# EAGLE design main_board (EAGLE 6.3)
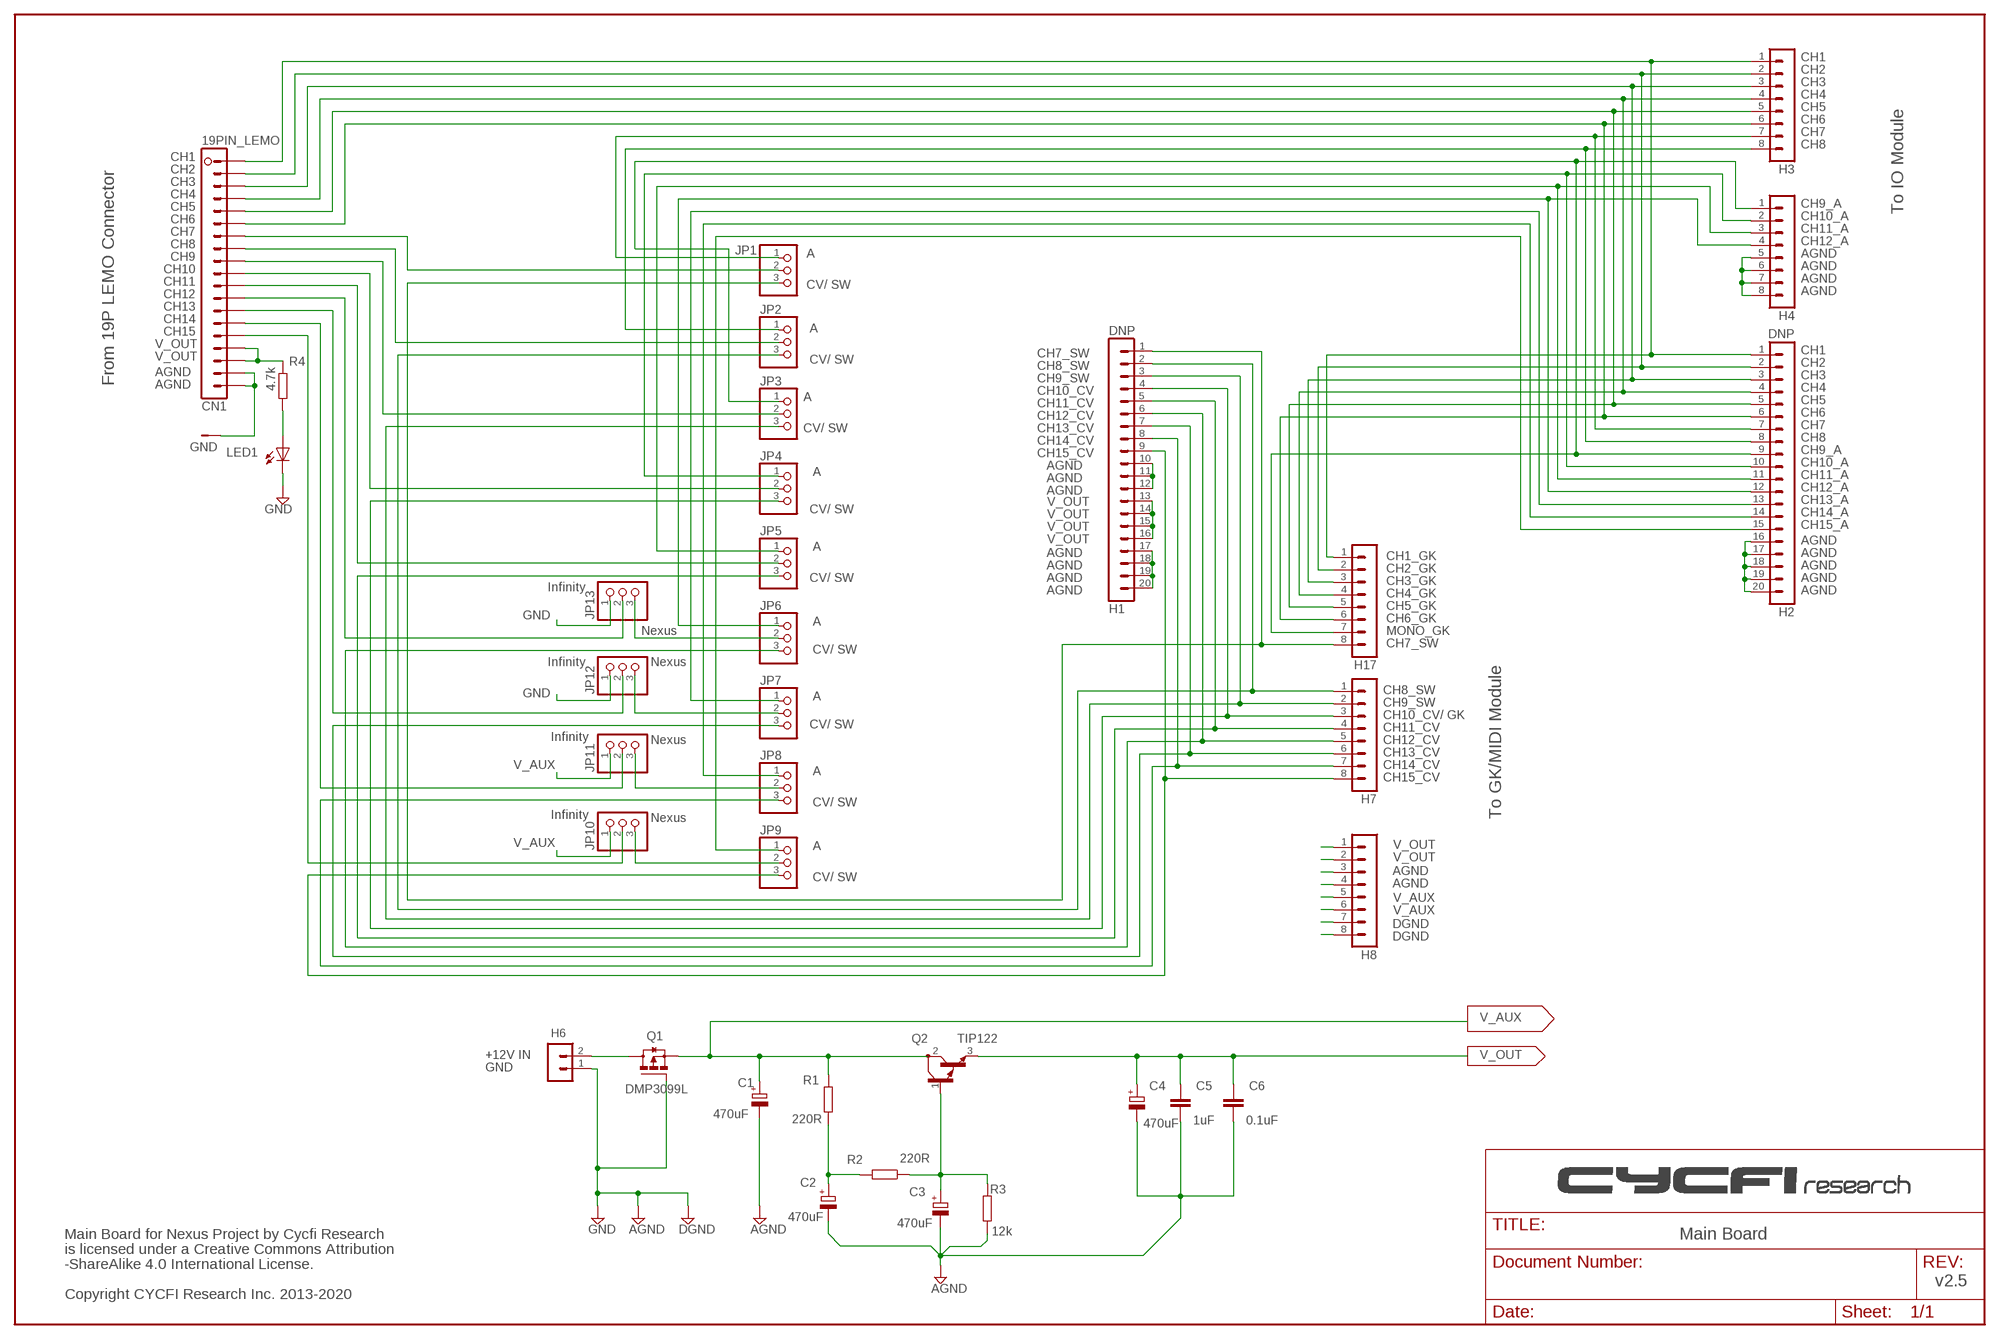
[diagram p0: schematic, sheet 1]

## Parts
C1  470uF  CPOL-EU140CLH-1010  [140CLH-1010]
C2  470uF  CPOL-EU140CLH-1010  [140CLH-1010]
C3  470uF  CPOL-EU140CLH-1010  [140CLH-1010]
C4  470uF  CPOL-EU140CLH-1010  [140CLH-1010]
C5  1uF  C-EUC0603  [C0603]
C6  0.1uF  C-EUC0603  [C0603]
CN1  19PIN_LEMO  [19PIN_LEMO]
GND  TH-PAD-1.6/0.8  [TH-PAD-1.6/0.8]
H1  DNP  MA20-1  [MA20-1]
H2  DNP  MA20-1  [MA20-1]
H3  MA08-1  [MA08-1]
H4  MA08-1  [MA08-1]
H6  MA02-1  [MA02-1]
H7  MA08-1  [MA08-1]
H8  MA08-1  [MA08-1]
H17  MA08-1  [MA08-1]
JP1  PINHD-1X03_2.00  [1X03M]
JP2  PINHD-1X03_2.00  [1X03M]
JP3  PINHD-1X03_2.00  [1X03M]
JP4  PINHD-1X03_2.00  [1X03M]
JP5  PINHD-1X03_2.00  [1X03M]
JP6  PINHD-1X03_2.00  [1X03M]
JP7  PINHD-1X03_2.00  [1X03M]
JP8  PINHD-1X03_2.00  [1X03M]
JP9  PINHD-1X03_2.00  [1X03M]
JP10  PINHD-1X03_2.00  [1X03M]
JP11  PINHD-1X03_2.00  [1X03M]
JP12  PINHD-1X03_2.00  [1X03M]
JP13  PINHD-1X03_2.00  [1X03M]
LED1  LED3MM  [LED3MM]
Q1  DMP3099L  P_MOSFET  [SOT23]
Q2  TIP122  [TO-220H]
R1  220R  R-EU_R0603  [R0603]
R2  220R  R-EU_R0603  [R0603]
R3  12k  R-EU_R0603  [R0603]
R4  4.7k  R-EU_R0402  [R0402]

## Nets
GND: C1.- C2.- C3.- C4.- C5.2 C6.2 CN1.P$18 CN1.P$19 GND.1(P) H1.10 H1.11 H1.12 H1.17 H1.18 H1.19 H1.20 H2.16 H2.17 H2.18 H2.19 H2.20 H4.5 H4.6 H4.7 H4.8 H6.1 H8.3 H8.4 H8.7 H8.8 JP12.1 JP13.1 LED1.K(C) Q1.1(G) R3.1 ; supply symbol labelled AGND, DGND
N$1: CN1.P$2 H2.2 H3.2 H17.2
N$2: CN1.P$1 H2.1 H3.1 H17.1
N$3: CN1.P$8 JP2.2
N$4: H6.2 Q1.3(D)
N$5: H1.2 H7.1 JP2.3
N$6: C3.+ Q2.1(B) R2.1 R3.2
N$7: H1.1 H17.8 JP1.3
N$8: C2.+ R1.1 R2.2
N$9: CN1.P$5 H2.5 H3.5 H17.5
N$10: JP9.2 JP10.3
N$11: H2.7 H3.7 JP1.1
N$12: CN1.P$7 JP1.2
N$13: H1.3 H7.2 JP3.3
N$14: CN1.P$10 JP4.2
N$15: CN1.P$11 JP5.2
N$16: CN1.P$12 JP13.2
N$17: CN1.P$9 JP3.2
N$18: H2.10 H4.2 JP4.1
N$19: H2.13 JP7.1
N$21: H2.14 JP8.1
N$22: H2.15 JP9.1
N$23: JP8.2 JP11.3
N$25: LED1.A R4.2
N$26: H1.5 H7.4 JP5.3
N$27: H1.4 H7.3 JP4.3
N$28: H2.12 H4.4 JP6.1
N$29: H2.11 H4.3 JP5.1
N$30: H1.6 H7.5 JP6.3
N$31: CN1.P$3 H2.3 H3.3 H17.3
N$32: H2.9 H4.1 H17.7 JP3.1
N$33: H1.7 H7.6 JP7.3
N$34: H1.8 H7.7 JP8.3
N$35: H1.9 H7.8 JP9.3
N$36: CN1.P$13 JP12.2
N$37: CN1.P$14 JP11.2
N$38: CN1.P$15 JP10.2
N$39: CN1.P$4 H2.4 H3.4 H17.4
N$40: JP7.2 JP12.3
N$41: CN1.P$6 H2.6 H3.6 H17.6
N$43: H2.8 H3.8 JP2.1
N$44: JP6.2 JP13.3
V_AUX: C1.+ H8.5 H8.6 JP10.1 JP11.1 Q1.2(S) Q2.2(C) R1.2
V_OUT: C4.+ C5.1 C6.1 CN1.P$16 CN1.P$17 H1.13 H1.14 H1.15 H1.16 H8.1 H8.2 Q2.3(E) R4.1

## Notes on the sheet
- CH1
- CH2
- CH3
- CH4
- CH5
- CH6
- CH7
- CH8
- CH1
- CH2
- CH3
- CH4
- CH5 | CH9_A
- To IO Module
- CH6 | CH10_A
- CH7 | CH11_A
- CH8 | CH12_A
- CH9 | A | AGND
- CH10 | AGND
- CH11 | AGND
- CV/ SW
- CH12 | AGND
- CH13
- CH14
- CH15 | A
- V_OUT
- CH7_SW | CH1
- V_OUT | CV/ SW
- CH8_SW | CH2
- AGND | CH3
- From 19P LEMO Connector | CH9_SW
- AGND | CH4
- CH10_CV
- A | CH5
- CH11_CV
- CH12_CV | CH6
- CV/ SW | CH13_CV | CH7
- CH14_CV | CH8
- CH15_CV | CH9_A
- AGND | CH10_A
- A | CH11_A
- AGND
- AGND | CH12_A
- V_OUT | CH13_A
- CV/ SW | CH14_A
- V_OUT
- V_OUT | CH15_A
- V_OUT | AGND
- A
- AGND | CH1_GK | AGND
- AGND | CH2_GK | AGND
- CV/ SW | AGND | CH3_GK | AGND
- Infinity | AGND | AGND
- CH4_GK
- CH5_GK
- A | CH6_GK
- Nexus | MONO_GK
- CH7_SW
- CV/ SW
- Infinity | Nexus
- CH8_SW
- A
- CH9_SW
- CH10_CV/ GK
- CV/ SW | CH11_CV
- Infinity | Nexus | CH12_CV
- CH13_CV
- CH14_CV
- A
- CH15_CV
- CV/ SW
- Infinity | Nexus | To GK/MIDI Module
- A | V_OUT
- V_OUT
- AGND
- CV/ SW
- AGND
- V_AUX
- V_AUX
- DGND
- DGND
- H6
- +12V IN
- GND
- Main Board
- v2.5
- Main Board for Nexus Project by Cycfi Research
  is licensed under a Creative Commons Attribution
  -ShareAlike 4.0 International License.
  
  Copyright CYCFI Research Inc. 2013-2020

## Library data of the parts
C1-C4 = resistor:CPOL-EU: POLARIZED CAPACITOR, European symbol
C5 C6 = resistor:C-EU: CAPACITOR, European symbol
CN1 = CYCFI_Con:19PIN_LEMO
GND = CYCFI_Con:TH-PAD-1.6/0.8
H1 H2 = con-lstb:MA20-1: PIN HEADER; OC_FARNELL: unknown; OC_NEWARK: unknown
H3 H4 H7 H8 H17 = con-lstb:MA08-1: PIN HEADER; OC_FARNELL: unknown; OC_NEWARK: unknown
H6 = con-lstb:MA02-1
JP1-JP13 = pinhead-2:PINHD-1X03: PIN HEADER
LED1 = led:LED: LED OSRAM: - CHIPLED LG R971, LG N971, LY N971, LG Q971, LY Q971, LO R971, LY R971 LH N974, LH R974 LS Q976, LO Q976, LY Q976 LO Q996 - Hyper CHIPLED LW Q18S LB Q993, LB Q99A, LB R99A - SideLED LS A670, LO A670, LY A670, LG A670, LP A670 LB A673, LV A673, LT A673, LW A673 LH A674 LY A675 LS A676, LA A676, LO A676, LY A676, LW A676 LS A679, LY A679, LG A679 - Hyper Micro SIDELED® LS Y876, LA Y876, LO Y876, LY Y876 LT Y87S - SmartLED LW L88C, LW L88S LB L89C, LB L89S, LG L890 LS L89K, LO L89K, LY L89K LS L896, LA L896, LO L896, LY L896 - TOPLED LS T670, LO T670, LY T670, LG T670, LP T670 LSG T670, LSP T670, LSY T670, LOP T670, LYG T670 LG T671, LOG T671, LSG T671 LB T673, LV T673, LT T673, LW T673 LH T674 LS T676, LA T676, LO T676, LY T676, LB T676, LH T676, LSB T676, LW T676 LB T67C, LV T67C, LT T67C, LS T67K, LO T67K, LY T67K, LW E67C LS E67B, LA E67B, LO E67B, LY E67B, LB E67C, LV E67C, LT E67C LW T67C LS T679, LY T679, LG T679 LS T770, LO T770, LY T770, LG T770, LP T770 LB T773, LV T773, LT T773, LW T773 LH T774 LS E675, LA E675, LY E675, LS T675 LS T776, LA T776, LO T776, LY T776, LB T776 LHGB T686 LT T68C, LB T68C - Hyper Mini TOPLED® LB M676 - Mini TOPLED Santana® LG M470 LS M47K, LO M47K, LY M47K Source: http://www.osram.convergy.de LUXEON: - LUMILED® LXK2-PW12-R00, LXK2-PW12-S00, LXK2-PW14-U00, LXK2-PW14-V00 LXK2-PM12-R00, LXK2-PM12-S00, LXK2-PM14-U00 LXK2-PE12-Q00, LXK2-PE12-R00, LXK2-PE12-S00, LXK2-PE14-T00, LXK2-PE14-U00 LXK2-PB12-K00, LXK2-PB12-L00, LXK2-PB12-M00, LXK2-PB14-N00, LXK2-PB14-P00, LXK2-PB14-Q00 LXK2-PR12-L00, LXK2-PR12-M00, LXK2-PR14-Q00, LXK2-PR14-R00 LXK2-PD12-Q00, LXK2-PD12-R00, LXK2-PD12-S00 LXK2-PH12-R00, LXK2-PH12-S00 LXK2-PL12-P00, LXK2-PL12-Q00, LXK2-PL12-R00 Source: www.luxeon.com KINGBRIGHT: KA-3528ASYC Source: www.kingbright.com
Q1 = CYCFI_semicon:P_MOSFET
Q2 = CYCFI_semicon:TIP122
R1-R4 = resistor:R-EU_: RESISTOR, European symbol

## Board
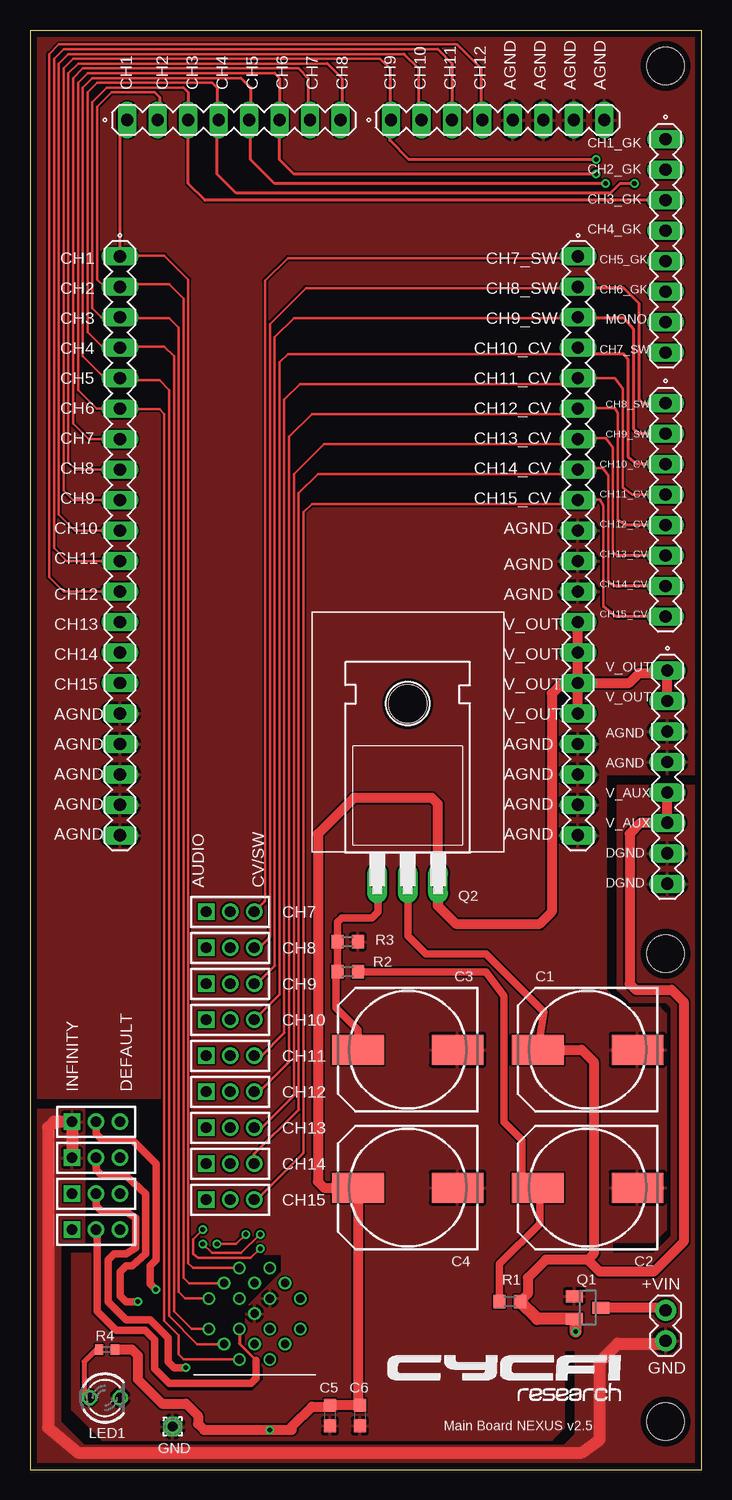
[diagram p1: board, top side]
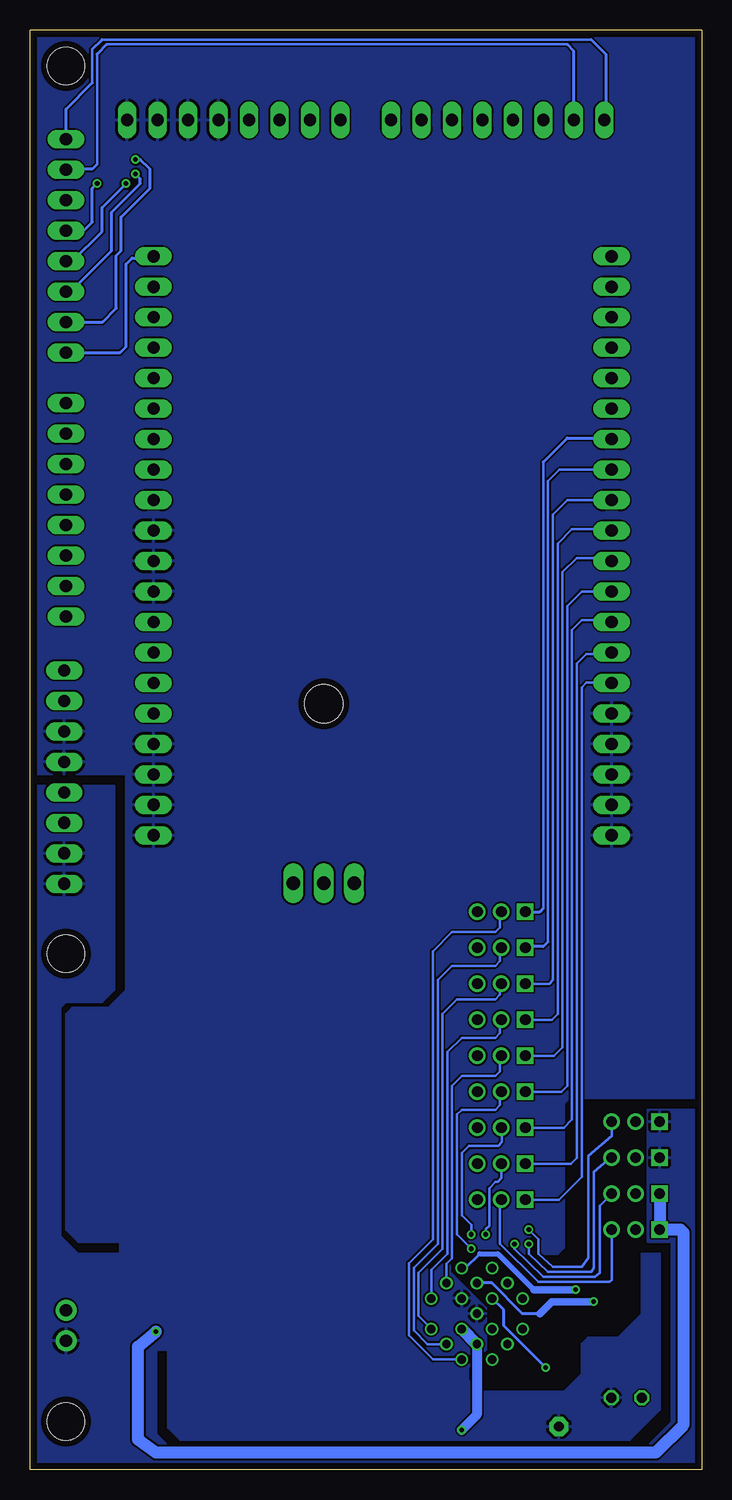
[diagram p2: board, bottom side, seen from below]

Size 56 x 120 mm. Coordinates in mm from the lower left corner, seen from the top.
Outline: 0,0 56,0 56,120 0,120 0,0
Copper layers (1*16): Top 0.035mm / dielectric 1.6mm / Bottom 0.035mm
Design rules "Elecrow_2-layer_PCB_eagle_rule": minimum track width 6mil, minimum drill 12mil, track to track 6mil, track to pad 8mil, pad to pad 12mil, via to via 12mil, smd to smd 0mil, copper to edge 20mil, drill to drill 10mil, minimum pad ring 6mil, minimum via ring 6mil, stop-mask expansion 0mil, vias tented up to drill 100mil, thermal gap 10mil
Holes 3.1 mm at 53,117 53,43 53,4
Holes 3.2 mm at 31.5,63.85

### Footprints (pad centres in the part's own frame; a part is rotated, then mirrored left to right if it is on the bottom)
140CLH-1010 = smd 4.3 x 2.5: + 4.15,0; - -4.15,0
C0603 = smd 1.1 x 1: 1 -0.85,0; 2 0.85,0
19PIN_LEMO = drill 0.7: P$1 -3.81,-1.27; P$2 -2.54,-2.54; P$3 -1.27,-3.81; P$4 1.27,-3.81; P$5 2.54,-2.54; P$6 3.81,-1.27; P$7 3.81,1.27; P$8 2.54,2.54; P$9 1.27,3.81; P$10 -1.27,3.81; P$11 -2.54,2.54; P$12 -3.81,1.27; P$13 -2.54,0; P$14 -1.27,-1.27; P$15 1.27,-1.27; P$16 2.54,0; P$17 1.27,1.27; P$18 -1.27,1.27; P$19 0,0
TH-PAD-1.6/0.8 = drill 0.813 pad 1.6 octagon: 1 0,0
MA20-1 = drill 1.016 long: 1 -24.13,0; 2 -21.59,0; 3 -19.05,0; 4 -16.51,0; 5 -13.97,0; 6 -11.43,0; 7 -8.89,0; 8 -6.35,0; 9 -3.81,0; 10 -1.27,0; 11 1.27,0; 12 3.81,0; 13 6.35,0; 14 8.89,0; 15 11.43,0; 16 13.97,0; 17 16.51,0; 18 19.05,0; 19 21.59,0; 20 24.13,0
MA08-1 = drill 1.016 long: 1 -8.89,0; 2 -6.35,0; 3 -3.81,0; 4 -1.27,0; 5 1.27,0; 6 3.81,0; 7 6.35,0; 8 8.89,0
MA02-1 = drill 1.016 pad 1.75: 1 -1.27,0; 2 1.27,0
1X03M = drill 0.914 square: 1 -2,0 | drill 0.914: 2 0,0; 3 2,0
LED3MM = drill 0.813 octagon: A -1.27,0; K 1.27,0
SOT23 = smd 1 x 1.4: 1 -0.95,-1.1; 2 0.95,-1.1; 3 0,1.1
TO-220H = drill 1.118 long: 1 -2.54,-7.62; 2 0,-7.62; 3 2.54,-7.62
R0603 = smd 1 x 1.1: 1 -0.85,0; 2 0.85,0
R0402 = smd 0.7 x 0.9: 1 -0.65,0; 2 0.65,0

### Placement (x,y rotation side)
C1  46.5,35 180 top
C2  46.5,23.5 180 top
C3  31.5,35 180 top
C4  31.5,23.5 180 top
C5  25,4.5 270 top
C6  27.5,4.5 270 top
CN1  18.73,12.99 270 top
GND  11.9,3.58 0 top
H1  45.7,77 270 top
H2  7.5,77 270 top
H3  17,112.5 0 top
H4  39,112.5 0 top
H6  53,12 90 top
H7  53,80 270 top
H8  53.15,57.72 270 top
H17  53,102 270 top
JP1  16.7,46.5 0 top
JP2  16.7,43.5 0 top
JP3  16.7,40.5 0 top
JP4  16.7,37.5 0 top
JP5  16.7,34.5 0 top
JP6  16.7,31.5 0 top
JP7  16.7,28.5 0 top
JP8  16.7,25.5 0 top
JP9  16.7,22.5 0 top
JP10  5.5,20 0 top
JP11  5.5,23 0 top
JP12  5.5,26 0 top
JP13  5.5,29 0 top
LED1  6.25,5.97 0 top
Q1  46.5,13.5 270 top
Q2  31.5,56.5 0 top
R1  40.01,14 0 top
R2  26.5,41.5 0 top
R3  26.5,44 180 top
R4  6.42,10 180 top

### Tracks (layer width: path | path; a pad name or v marks a point on that pad's centre or on a via)
GND
  Top 1.016: H6.1 52.77,10.5 49,10.5 47.5,9 47.5,2.5 46,1.4 4,1.4 1.5,3.5 1.5,28.5 2,29 JP13.1 JP12.1
  pour Top: 56,57 49,57 49,40 50,39 53,39 53.5,38.5 53.5,19.5 52,18 48.5,18 48.5,19 52,19 53,20 53,38 52.5,38.5 49.5,38.5 48,40 48,58 56,58 56,120 0,120 0,31 11,31 11.5,30.5 11.5,18.5 12,18 21,18 21,16.5 18,13.5 18,10 19.5,8.5 19.5,7.5 18.5,6.5 11.5,6.5 10,8 10,10.5 9.5,11 7,11 5,13 5,18 3.5,18 3.5,5 6,2.5 43.5,2.5 44.5,3.5 44.5,10 45.5,10 45.5,3 44.5,2 4.5,2 2.5,4 2.5,19 4.5,19 4.5,30 0,30 0,0 56,0
  pour Bottom: 56,57 49,57 49,40 50,39 53,39 53.5,38.5 53.5,19.5 52,18 48.5,18 48.5,19 52,19 53,20 53,38 52.5,38.5 49.5,38.5 48,40 48,58 56,58 56,120 0,120 0,31 11,31 11.5,30.5 11.5,18.5 12,18 21,18 21,16.5 18,13.5 18,10 19.5,8.5 19.5,7.5 18.5,6.5 11.5,6.5 10,8 10,10.5 9.5,11 7,11 5,13 5,18 3.5,18 3.5,5 6,2.5 43.5,2.5 44.5,3.5 44.5,10 45.5,10 45.5,3 44.5,2 4.5,2 2.5,4 2.5,19 4.5,19 4.5,30 0,30 0,0 56,0
N$1
  Top 0.203: CN1.P$2 13.27,15.53 12.8,16 12.8,97.6 11.6,98.8 7.71,98.8 H2.2 6.21,98.59 5.6,99.2 5.6,113.6 6.8,114.8 10.4,114.8
  Top 0.254: 10.4,114.8 10.8,114.4 10.8,113.15 H3.2
  Bottom 0.203: 11.2,118.8 49.6,118.8 | 50.4,118 50.4,108.8
  Bottom 0.254: H3.2 10.65,118.25 11.2,118.8 | 49.6,118.8 50.4,118 | 50.4,108.8 50.8,108.4 52.95,108.4 H17.2
N$2
  Top 0.203: CN1.P$1 13.6,16.8 13.2,17.2 13.2,99.2 11.2,101.2 7.57,101.2 H2.1
  Top 0.254: H2.1 7.5,112.39 H3.1
  Bottom 0.203: 50.8,115.6 50.8,118.4 | 50,119.2 9.2,119.2
  Bottom 0.254: H17.1 53,113.4 50.8,115.6 | 50.8,118.4 50,119.2 | 9.2,119.2 8,118 8,113.11 H3.1
N$3
  Bottom 0.203: CN1.P$8 22.85,10.45 24,11.6 24,16.8 22,18.8 22,40.8 20.8,42 17.2,42 16.8,42.4 16.8,43.4 JP2.2
N$4
  Top 0.813: H6.2 52.77,13.5 Q1.3
N$5
  Top 0.203: 20,44.4 20,95.5 23,98.5 45.61,98.5 H1.2
  Top 0.254: JP2.3 19.1,43.5 20,44.4 | H7.1 52.91,88.8 51.2,88.8 50.8,89.2 50.8,97.2 49.5,98.5 45.79,98.5 H1.2
N$6
  Top 0.61: C3.+ 27.35,36.65 25.5,38.5 25.5,41.35 R2.1 R3.2 25.65,45.65 26,46 28.5,46 29,46.5 29,48.74 Q2.1
N$7
  Top 0.203: 19.6,47.4 19.6,99.1 21.5,101 45.57,101 H1.1
  Top 0.254: 19.6,47.4 JP1.3
  Bottom 0.254: H17.8 48.49,93.11 48,93.6 48,100.5 47.5,101 45.83,101 H1.1
N$8
  Top 0.406: 41.35,23 41,23
  Top 0.61: R1.1 39.16,17.16 42.5,20.5 42.5,23.35 C2.+ | 41,23 41,27.5 39.5,29 39.5,39.5 38,41.5 R2.2
  Top 1.016: 41.35,23 C2.+
N$9  (via drill 0.4)
  Top 0.203: CN1.P$5 13.95,10.45 11.6,12.8 11.6,90 10.8,90.8 7.67,90.8 H2.5 6.23,90.97 4.4,92.8 4.4,115.2 5.2,116 17.6,116
  Top 0.254: 17.6,116 18.4,115.2 18.4,113.13 H3.5 18.4,112.87 18.4,109.2 20.4,107.2 v48,107.2
  Bottom 0.254: H17.5 52.47,100.73 50,103.2 50,105.2 v48,107.2
N$10
  Bottom 0.203: JP10.3 7.5,15.8 7.7,15.65 13.6,15.65 16.8,18.8 16.8,22.4 JP9.2
N$11
  Top 0.203: H2.7 4.91,85.89 3.6,87.2 3.6,116 4.4,116.8 22.4,116.8
  Top 0.254: 22.4,116.8 23.2,116 23.2,113.15 H3.7
  Bottom 0.203: 13.2,46.8 13.2,84
  Bottom 0.254: JP1.1 13.5,46.5 13.2,46.8 | 13.2,84 11.2,86 7.61,86 H2.7
N$12
  Bottom 0.203: CN1.P$7 22.38,9.18 24.4,11.2 24.4,17.2 22.4,19.2 22.4,43.2 20.8,44.8 17.2,44.8 16.8,45.2 16.8,46.4 JP1.2
N$13
  Top 0.203: 20.4,42 20.4,94.4 22,96 45.65,96 H1.3
  Top 0.254: JP3.3 18.9,40.5 20.4,42 | H7.2 50.85,86.35 50.34,86.74 50.34,95.04 49.5,96 45.75,96 H1.3
N$14
  Bottom 0.203: CN1.P$10 22.54,16.66 21.2,18 21.2,34.8 20,36 17.2,36 16.8,36.4 16.8,37.4 JP4.2
N$15
  Bottom 0.203: CN1.P$11 21.27,17.13 20.8,17.6 20.8,32 20,32.8 17.2,32.8 16.8,33.2 16.8,34.4 JP5.2
N$16  (via drill 0.4)
  Top 0.61: v10.5,15 10,15.5 10,17 10.5,17.5 10.5,25.5 8.5,27.5 6,27.5 5.5,28 JP13.2
  Bottom 0.254: CN1.P$12 19.7,16.8 18.5,18
  Bottom 0.406: 18.5,18 17,18 14,15
  Bottom 0.61: 14,15 v10.5,15
N$17
  Bottom 0.203: CN1.P$9 22.54,11.74 23.6,12.8 23.6,16.4 21.6,18.4 21.6,38 20.4,39.2 17.2,39.2 16.8,39.6 16.8,40.4 JP3.2
N$18
  Top 0.203: H2.10 3.73,78.27 2.4,79.6 2.4,117.2 3.2,118 31.2,118
  Top 0.254: 31.2,118 32.4,116.8 32.4,113.25 H4.2
  Bottom 0.203: JP4.1 12.5,37.5 12,38 12,77.2 10.8,78.4 7.63,78.4 H2.10
N$19
  Bottom 0.203: JP7.1 11.5,28.5 10.8,29.2 10.8,70 10,70.8 7.65,70.8 H2.13
N$21
  Bottom 0.203: JP8.1 10.9,25.5 10.4,26 10.4,67.2 9.6,68 7.61,68 H2.14
N$22
  Bottom 0.203: JP9.1 11.9,22.5 10,24.4 10,65.2 9.6,65.6 7.53,65.6 H2.15
N$23  (via drill 0.4)
  Top 0.203: v15.6,18.8 17.2,18.8 v18,19.6
  Bottom 0.203: JP11.3 8.5,22 8.5,16.4 8.9,16.05 13.2,16.05 15.6,18.4 v15.6,18.8 | v18,19.6 18,20.05 17.7,20.3 17.7,23.45 17.2,24 17,24 16.7,24.3 JP8.2
N$25
  Top 0.406: R4.2 5.5,10 4.5,9 4.5,6.46 LED1.A
N$26
  Top 0.203: 21.2,36.4 21.2,89.2 22.5,90.5 45.23,90.5 H1.5 45.73,91 48.75,91 49.44,90.12 49.44,81.88 50.23,81.27 H7.4
  Top 0.254: JP5.3 19.3,34.5 21.2,36.4
N$27
  Top 0.203: 20.8,39.6 20.8,92.3 21.5,93 45.19,93 H1.4
  Top 0.254: JP4.3 20.8,39.6 | H7.3 50.59,83.81 49.88,84.4 49.88,92.5 49.5,93 46.21,93 H1.4
N$28
  Top 0.203: H2.12 2.81,73.19 1.6,74.4 1.6,118 2.4,118.8 35.6,118.8
  Top 0.254: 35.6,118.8 37.6,116.8 37.6,113.13 H4.4
  Bottom 0.203: JP6.1 11.7,31.5 11.2,32 11.2,72 10,73.2 H2.12
N$29
  Top 0.203: H2.11 3.07,75.73 2,76.8 2,117.6 2.8,118.4 34,118.4
  Top 0.254: 34,118.4 35.2,117.2 35.2,113.01 H4.3
  Bottom 0.203: JP5.1 12.3,34.5 11.6,35.2 11.6,74.8 10.4,76 7.77,76 H2.11
N$30
  Top 0.203: 21.6,34 21.6,86.1 23.5,88 45.27,88 H1.6 45.77,88.5 48.75,88.5 49.01,88.05 49.01,79.2
  Top 0.254: JP6.3 19.1,31.5 21.6,34 | H7.5 49.67,78.73 49.01,79.2
N$31
  Top 0.203: CN1.P$3 12.94,14.26 12.4,14.8 12.4,95.2 11.6,96 7.55,96 H2.3 5.95,96.05 5.2,96.8 5.2,114 6.4,115.2 12.8,115.2
  Top 0.254: 12.8,115.2 13.2,114.8 13.2,113.01 H3.3 13.2,112.99 13.2,107.2 14.59,105.81 H17.3
N$32  (via drill 0.4)
  Top 0.203: H2.9 3.59,80.81 2.8,81.6 2.8,116.8 3.6,117.6 29.2,117.6
  Top 0.254: 29.2,117.6 30,116.8 30,113.11 H4.1 30,112.89 30,110.8 31.6,109.2 v47.2,109.2
  Bottom 0.203: JP3.1 12.7,40.5 12.4,40.8 12.4,79.6 11.2,80.8 H2.9
  Bottom 0.254: H17.7 49.95,95.65 48.8,96.8 48.8,101.2 48.4,101.6 48.4,104.4 46,106.8 46,108.4 46.8,109.2 v47.2,109.2
N$33
  Top 0.203: 22,31.2 22,83 24.5,85.5 45.31,85.5 H1.7 45.81,86 48,86 48.61,85.2 48.61,76.4
  Top 0.254: JP7.3 19.3,28.5 22,31.2 | H7.6 49.01,76.19 48.61,76.4
N$34
  Top 0.203: 22.4,30 22.4,81.4 24,83 45.35,83 H1.8 45.85,83.5 47.75,83.5 48.21,82.85 48.21,74
  Top 0.254: JP8.3 18.7,26.3 22.4,30 | H7.7 48.75,73.65 48.21,74
N$35
  Top 0.203: 22.8,26.4 22.8,79.8 23.5,80.5 45.39,80.5 H1.9 45.77,80.88 47.5,80.88 47.81,80.38 47.81,72
  Top 0.254: JP9.3 18.9,22.5 22.8,26.4 | H7.8 48.89,71.11 47.81,72
N$36  (via drill 0.4)
  Top 0.61: JP12.2 5.5,25 6,24.5 8,24.5 9.65,23 9.65,18 8.5,17 8,17 7.5,16.5 7.5,14.5 8,14 v9,14
  Bottom 0.254: 13.5,13 14.95,13 17.5,15.55 18.71,15.55 CN1.P$13
  Bottom 0.61: v9,14 12.5,14 13.5,13
N$37  (via drill 0.4)
  Top 0.61: JP11.2 5.5,22 6,21.5 8,21.5 8.8,21 8.8,18.5 8,18 7,18 6.5,17.5 6.5,14 8,12.5 10,12.5 11.5,11 11.5,9 12,8.5 v13,8.5
  Bottom 0.254: v13,8.5 16.5,12 16.5,13.3 CN1.P$14
  Bottom 0.406: CN1.P$14 17.26,14.26
N$38
  Top 0.254: CN1.P$15 17.46,10.49 18.85,9.1
  Top 0.61: JP10.2 5.6,19.9 5.6,13.2 7.2,11.6 9.6,11.6 10.4,10.8 10.4,8.4 11.6,7.2 18.45,7.2 18.85,7.6 18.85,9.1
N$39  (via drill 0.4)
  Top 0.203: CN1.P$4 13.48,11.72 12,13.2 12,92.8 11.2,93.6 7.59,93.6 H2.4 6.09,93.51 4.8,94.8 4.8,114.8 5.6,115.6 15.2,115.6
  Top 0.254: 15.2,115.6 15.6,115.2 15.6,113.13 H3.4 15.6,112.87 15.6,108 17.2,106.4 48.4,106.4 49.2,107.2 v50.4,107.2
  Bottom 0.254: H17.4 51.53,103.27 50.8,104 50.8,106.8 v50.4,107.2
N$40  (via drill 0.4)
  Top 0.203: v14.4,18.8 15.2,18.05 17.6,18.05 v19.2,19.6
  Bottom 0.203: JP12.3 7.6,26 9,24.8 9,16.8 9.2,16.5 12.8,16.5 14.4,18 v14.4,18.8 | v19.2,19.6 19.2,20.4 20,21.2 20,26.4 19.4,27 16.95,27 16.65,27.3 16.65,28.45 JP7.2
N$41  (via drill 0.4)
  Top 0.203: CN1.P$6 12.82,9.18 12.4,9.6 12.4,11.2 11.2,12.4 11.2,88 10.8,88.4 7.53,88.4 H2.6 5.57,88.43 4,90 4,115.6 4.8,116.4 20.4,116.4
  Top 0.254: 20.4,116.4 20.8,116 20.8,113.01 H3.6 20.8,112.99 20.8,109.2 22,108 v47.2,108
  Bottom 0.254: H17.6 52.61,98.19 49.2,101.6 49.2,104.8 46.8,107.2 46.8,107.6 v47.2,108
N$43
  Top 0.203: H2.8 3.85,83.35 3.2,84 3.2,116.4 4,117.2 24.8,117.2
  Top 0.254: 24.8,117.2 26,116 26,113.11 H3.8
  Bottom 0.203: H2.8 11.85,83.35 12.8,82.4 12.8,44
  Bottom 0.254: 12.8,44 13.2,43.6 14.6,43.6 JP2.1
N$44  (via drill 0.4)
  Top 0.203: v14.4,20 13.6,19.2 13.6,18 14,17.65 18.4,17.65 v19.2,18.4
  Bottom 0.203: JP13.3 7.5,27.8 9.45,26.15 9.45,17.65 10,16.9 12.4,16.9 13.6,18 13.6,19.2 v14.4,20 | v19.2,18.4 20.4,19.6 20.4,29.6 20,30 17.2,30 16.8,30.4 16.8,31.4 JP6.2
V_AUX  (via drill 0.4)
  Top 0.61: C1.+ 42.85,38.15 38,43 33,43 31.5,44.5 Q2.2
  Top 0.813: H8.5 H8.6 50.91,53.91 50,53 50,40.5 50.5,40 53.5,40 54.5,39 54.5,19 52,16.5 47.5,16.5 46.5,17.5 | C1.+ 46,35 47,34 47,18 46.5,17.5 | 46.5,17.5 43,17.5 41.5,16 41.5,14.64 R1.2
  Top 1.016: R1.2 42.31,12.55 Q1.2 45.5,12.45 v45.5,11.5
  Bottom 1.016: JP11.1 JP10.1 1.75,20 1.5,19.75 1.5,3.75 3.85,1.4 45.5,1.4 47,2.5 47,10.25 v45.5,11.5
V_OUT  (via drill 0.4)
  Top 0.813: R4.1 8.5,10 9,9.5 9,7.5 11,5.5 13,5.5 14,4.5 14,3.8 14.5,3.3 v20,3.3 21.85,3.3 21.85,3.6 23.5,5.25 24.9,5.25 C5.1 C6.1 | H1.15 H1.14 H1.13 | 53.11,64.11 H8.2 H8.1 52.94,66.4 50.8,66.4 49.97,65.57 H1.15 | H1.15 46.47,65.6 44.4,65.6 43.5,64.7 43.5,46.5 42.5,45.5 35.5,45.5 34.04,46.96 | Q2.3 34.04,46.96 | 34.04,46.96 34,47 34,55.5 33.5,56 27,56 24,53 24,24 24.5,23.5 C4.+ 27.35,5.5 C6.1 | 27.45,5.3 C6.1 | H1.16 H1.15
  Bottom 0.813: CN1.P$16 18.73,4.57 v20,3.3
  Bottom 1.016: CN1.P$16 CN1.P$17

### Text on the board
tNames: CH1 | CH2 | CH3 | CH4 | CH5 | CH6 | CH7 | CH8 | CH9 | CH10 | CH11 | CH12 | AGND | AGND | AGND | AGND | CH1_GK | CH2_GK | CH3_GK | CH4_GK | CH1 | CH7_SW | CH5_GK | CH2 | CH8_SW | CH6_GK | CH3 | CH9_SW | MONO | CH4 | CH10_CV | CH7_SW | CH5 | CH11_CV | CH6 | CH12_CV | CH8_SW | CH7 | CH13_CV | CH9_SW | CH10_CV | CH8 | CH14_CV | CH11_CV | CH9 | CH15_CV | CH10 | AGND | CH12_CV | CH11 | CH13_CV | AGND | CH14_CV | CH12 | AGND | CH15_CV | CH13 | V_OUT | CH14 | V_OUT | V_OUT | CH15 | V_OUT | V_OUT | AGND | V_OUT | AGND | AGND | AGND | AGND | AGND | AGND | V_AUX | AGND | AGND | V_AUX | AGND | AGND | DGND | AUDIO | CV/SW | DGND | CH7 | CH8 | CH9 | CH10 | CH11 | INFINITY | DEFAULT | CH12 | CH13 | CH14 | CH15 | +VIN | GND | Main Board NEXUS v2.5